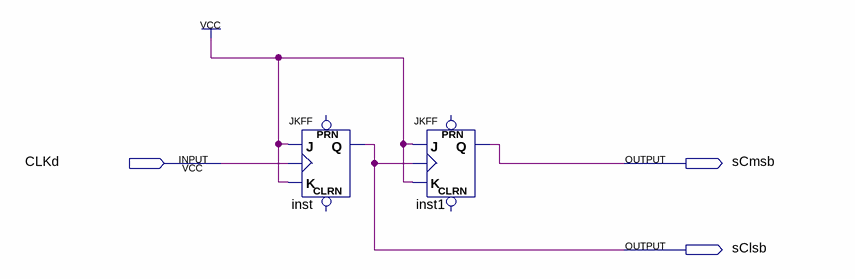
[diagram p0: schematic sheet]
// Quartus schematic contador.bdf as structural Verilog: 2 symbols, 3 pins
module contador (
  input  CLKd,
  output sCmsb,
  output sClsb
);

  JKFF inst (.K(1'b1), .J(1'b1), .CLK(CLKd), .Q(sClsb));  // open: PRN, CLRN
  JKFF inst1 (.K(1'b1), .J(1'b1), .CLK(sClsb), .Q(sCmsb));  // open: PRN, CLRN
endmodule
